# Altium schematic sheet Power Subsystem.SchDoc
size A; SheetNumber: 2; SheetTotal: 7
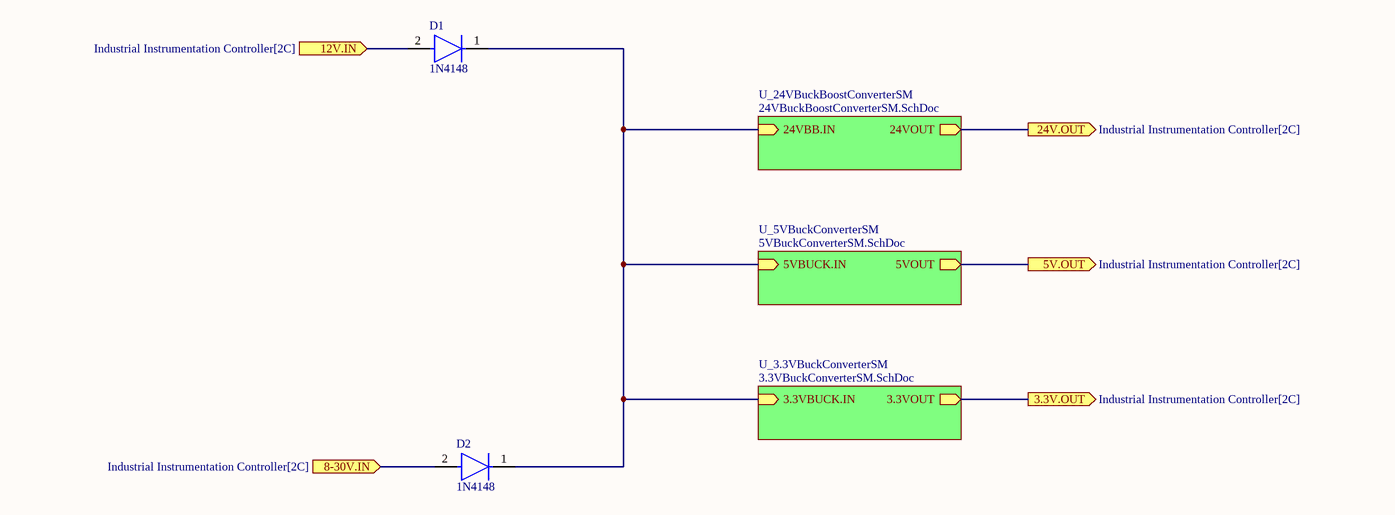
[diagram p0: Power Subsystem.SchDoc]

## Parts
D1  1N4148  [FP-017AG-MFG]
D2  1N4148  [FP-017AG-MFG]

## Sub-sheets
U_3.3VBuckConverterSM = 3.3VBuckConverterSM.SchDoc: 3.3VOUT (out), 3.3VBUCK.IN (in)
U_5VBuckConverterSM = 5VBuckConverterSM.SchDoc: 5VOUT (out), 5VBUCK.IN (in)
U_24VBuckBoostConverterSM = 24VBuckBoostConverterSM.SchDoc: 24VOUT (out), 24VBB.IN (in)

## Ports
3.3V.OUT (out, see Industrial Instrumentation Controller[2C]), 5V.OUT (out, see Industrial Instrumentation Controller[2C]), 8-30V.IN (in, see Industrial Instrumentation Controller[2C]), 12V.IN (in, see Industrial Instrumentation Controller[2C]), 24V.OUT (out, see Industrial Instrumentation Controller[2C])

## Nets
3.3V.OUT: port 3.3V.OUT, sheet U_3.3VBuckConverterSM/3.3VOUT
5V.OUT: port 5V.OUT, sheet U_5VBuckConverterSM/5VOUT
8-30V.IN: D2.2(A) ; port 8-30V.IN
12V.IN: D1.2(A) ; port 12V.IN
24V.OUT: port 24V.OUT, sheet U_24VBuckBoostConverterSM/24VOUT
NetD1_1: D1.1(C) D2.1(C) ; sheet U_24VBuckBoostConverterSM/24VBB.IN, sheet U_3.3VBuckConverterSM/3.3VBUCK.IN, sheet U_5VBuckConverterSM/5VBUCK.IN

## Library data of the parts
D1 D2 = CMP-07163-000046-1: DIODE GEN PURP 100V 200MA DO35; Forward Voltage: 1V; Max Power Dissipation: 500mW; Max Reverse Current: 5uA; Forward Current: 300mA; Current: 4A; Reverse Recovery Time: 4ns; Element Configuration: Single; Outside Diameter: 1.85mm; Capacitance: 4pF; Polarity: Standard; Max Forward Surge Current (Ifsm): 1A; Reverse Voltage: 100V; Output Current: 200mA; Average Rectified Current: 200mA; Diameter: 1.91mm; Max Repetitive Reverse Voltage (Vrrm): 100V; Current Rating: 200mA; Case/Package: DO-35; Lead Free: Lead Free; Number of Pins: 2; Recovery Time: 4ns; Packaging: Bulk; Contact Plating: Tin; Voltage: 100V; Mount: Through Hole; Max Surge Current: 4A; Package Quantity: 2000; Width: 1.91mm; Max Reverse Voltage (DC): 100V; Length: 4.56mm; Radiation Hardening: No; Power Dissipation: 500mW; Voltage Rating (DC): 100V; Peak Non-Repetitive Surge Current: 4A; REACH SVHC: No SVHC; Height: 4.56mm; Max Operating Temperature: 175°C; Series: -; Weight: 0.01lb; Min Operating Temperature: -65°C